# Altium schematic sheet FPGA_bank15_16.SchDoc
size 420 x 297 mm
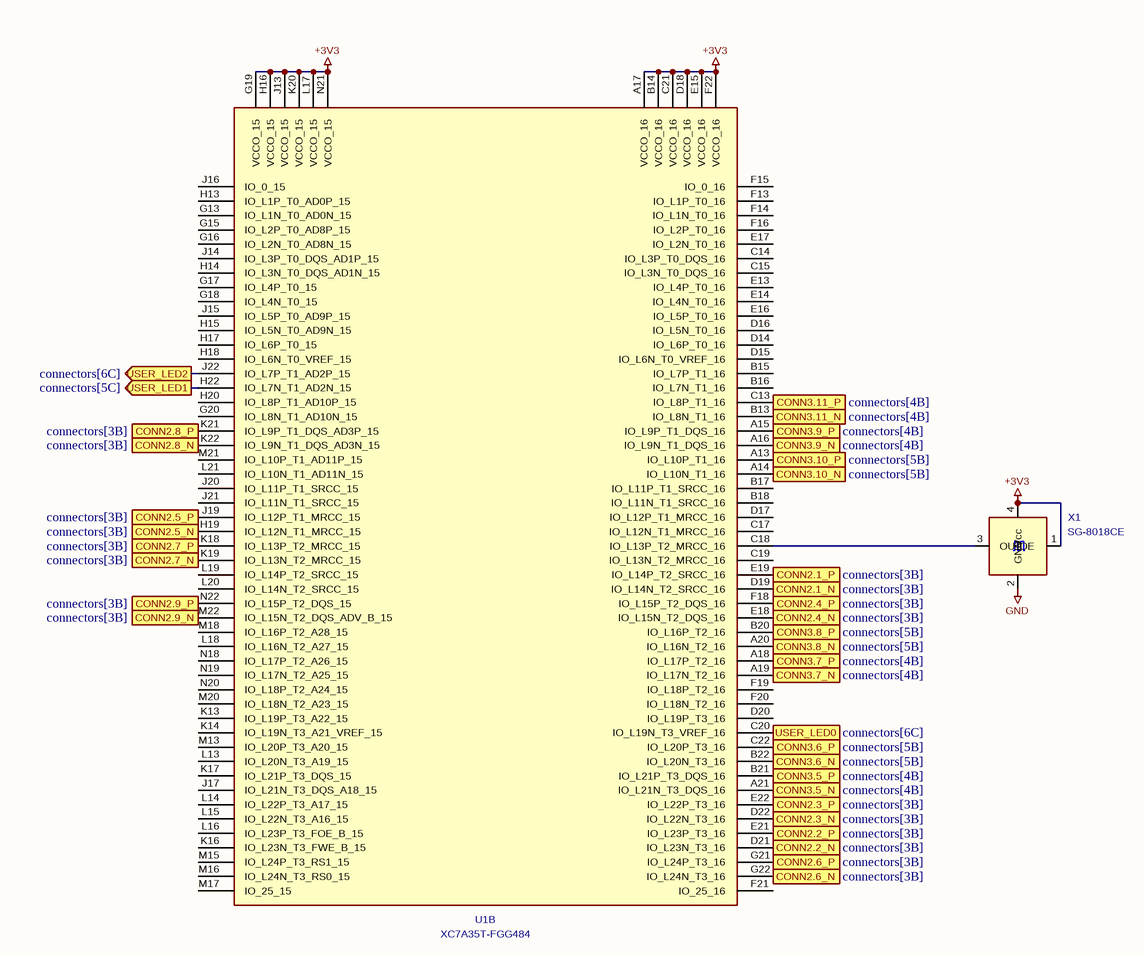
[diagram p0: FPGA_bank15_16.SchDoc]

## Parts
U1  XC7A35T-FGG484  [FB-BGA-484_23.0x23.0mm_Layout22x22_P1.0mm]  (part B of 7)
X1  SG-8018CE  [Crystal_SMD_3225-4Pin_3.2x2.5mm]

## Ports
CONN2.1_N (in, see connectors[3B]), CONN2.1_P (in, see connectors[3B]), CONN2.2_N (in, see connectors[3B]), CONN2.2_P (in, see connectors[3B]), CONN2.3_N (in, see connectors[3B]), CONN2.3_P (in, see connectors[3B]), CONN2.4_N (in, see connectors[3B]), CONN2.4_P (in, see connectors[3B]), CONN2.5_N (in, see connectors[3B]), CONN2.5_P (in, see connectors[3B]), CONN2.6_N (in, see connectors[3B]), CONN2.6_P (in, see connectors[3B]), CONN2.7_N (in, see connectors[3B]), CONN2.7_P (in, see connectors[3B]), CONN2.8_N (in, see connectors[3B]), CONN2.8_P (in, see connectors[3B]), CONN2.9_N (in, see connectors[3B]), CONN2.9_P (in, see connectors[3B]), CONN3.5_N (in, see connectors[4B]), CONN3.5_P (in, see connectors[4B]), CONN3.6_N (in, see connectors[5B]), CONN3.6_P (in, see connectors[5B]), CONN3.7_N (in, see connectors[4B]), CONN3.7_P (in, see connectors[4B]), CONN3.8_N (in, see connectors[5B]), CONN3.8_P (in, see connectors[5B]), CONN3.9_N (in, see connectors[4B]), CONN3.9_P (in, see connectors[4B]), CONN3.10_N (in, see connectors[5B]), CONN3.10_P (in, see connectors[5B]), CONN3.11_N (in, see connectors[4B]), CONN3.11_P (in, see connectors[4B]), USER_LED0 (out, see connectors[6C]), USER_LED1 (out, see connectors[5C]), USER_LED2 (out, see connectors[6C])

## Nets
+3V3: U1.A17(VCCO_16) U1.B14(VCCO_16) U1.C21(VCCO_16) U1.D18(VCCO_16) U1.E15(VCCO_16) U1.F22(VCCO_16) U1.G19(VCCO_15) U1.H16(VCCO_15) U1.J13(VCCO_15) U1.K20(VCCO_15) U1.L17(VCCO_15) U1.N21(VCCO_15) X1.1(OE) X1.4(Vcc)
GND: X1.2(GND)
CONN2.1_N: U1.D19(IO_L14N_T2_SRCC_16) ; port CONN2.1_N
CONN2.1_P: U1.E19(IO_L14P_T2_SRCC_16) ; port CONN2.1_P
CONN2.2_N: U1.D21(IO_L23N_T3_16) ; port CONN2.2_N
CONN2.2_P: U1.E21(IO_L23P_T3_16) ; port CONN2.2_P
CONN2.3_N: U1.D22(IO_L22N_T3_16) ; port CONN2.3_N
CONN2.3_P: U1.E22(IO_L22P_T3_16) ; port CONN2.3_P
CONN2.4_N: U1.E18(IO_L15N_T2_DQS_16) ; port CONN2.4_N
CONN2.4_P: U1.F18(IO_L15P_T2_DQS_16) ; port CONN2.4_P
CONN2.5_N: U1.H19(IO_L12N_T1_MRCC_15) ; port CONN2.5_N
CONN2.5_P: U1.J19(IO_L12P_T1_MRCC_15) ; port CONN2.5_P
CONN2.6_N: U1.G22(IO_L24N_T3_16) ; port CONN2.6_N
CONN2.6_P: U1.G21(IO_L24P_T3_16) ; port CONN2.6_P
CONN2.7_N: U1.K19(IO_L13N_T2_MRCC_15) ; port CONN2.7_N
CONN2.7_P: U1.K18(IO_L13P_T2_MRCC_15) ; port CONN2.7_P
CONN2.8_N: U1.K22(IO_L9N_T1_DQS_AD3N_15) ; port CONN2.8_N
CONN2.8_P: U1.K21(IO_L9P_T1_DQS_AD3P_15) ; port CONN2.8_P
CONN2.9_N: U1.M22(IO_L15N_T2_DQS_ADV_B_15) ; port CONN2.9_N
CONN2.9_P: U1.N22(IO_L15P_T2_DQS_15) ; port CONN2.9_P
CONN3.5_N: U1.A21(IO_L21N_T3_DQS_16) ; port CONN3.5_N
CONN3.5_P: U1.B21(IO_L21P_T3_DQS_16) ; port CONN3.5_P
CONN3.6_N: U1.B22(IO_L20N_T3_16) ; port CONN3.6_N
CONN3.6_P: U1.C22(IO_L20P_T3_16) ; port CONN3.6_P
CONN3.7_N: U1.A19(IO_L17N_T2_16) ; port CONN3.7_N
CONN3.7_P: U1.A18(IO_L17P_T2_16) ; port CONN3.7_P
CONN3.8_N: U1.A20(IO_L16N_T2_16) ; port CONN3.8_N
CONN3.8_P: U1.B20(IO_L16P_T2_16) ; port CONN3.8_P
CONN3.9_N: U1.A16(IO_L9N_T1_DQS_16) ; port CONN3.9_N
CONN3.9_P: U1.A15(IO_L9P_T1_DQS_16) ; port CONN3.9_P
CONN3.10_N: U1.A14(IO_L10N_T1_16) ; port CONN3.10_N
CONN3.10_P: U1.A13(IO_L10P_T1_16) ; port CONN3.10_P
CONN3.11_N: U1.B13(IO_L8N_T1_16) ; port CONN3.11_N
CONN3.11_P: U1.C13(IO_L8P_T1_16) ; port CONN3.11_P
USER_LED0: U1.C20(IO_L19N_T3_VREF_16) ; port USER_LED0
USER_LED1: U1.H22(IO_L7N_T1_AD2N_15) ; port USER_LED1
USER_LED2: U1.J22(IO_L7P_T1_AD2P_15) ; port USER_LED2
NetU1_C18: U1.C18(IO_L13P_T2_MRCC_16) X1.3(OUT)

Not connected (* = marked no-connect by the designer): U1 B15(IO_L7P_T1_16) B16(IO_L7N_T1_16) B17(IO_L11P_T1_SRCC_16) B18(IO_L11N_T1_SRCC_16) C14(IO_L3P_T0_DQS_16) C15(IO_L3N_T0_DQS_16) C17(IO_L12N_T1_MRCC_16) C19(IO_L13N_T2_MRCC_16) D14(IO_L6P_T0_16) D15(IO_L6N_T0_VREF_16) D16(IO_L5N_T0_16) D17(IO_L12P_T1_MRCC_16) D20(IO_L19P_T3_16) E13(IO_L4P_T0_16) E14(IO_L4N_T0_16) E16(IO_L5P_T0_16) E17(IO_L2N_T0_16) F13(IO_L1P_T0_16) F14(IO_L1N_T0_16) F15(IO_0_16) F16(IO_L2P_T0_16) F19(IO_L18P_T2_16) F20(IO_L18N_T2_16) F21(IO_25_16) G13(IO_L1N_T0_AD0N_15) G15(IO_L2P_T0_AD8P_15) G16(IO_L2N_T0_AD8N_15) G17(IO_L4P_T0_15) G18(IO_L4N_T0_15) G20(IO_L8N_T1_AD10N_15) H13(IO_L1P_T0_AD0P_15) H14(IO_L3N_T0_DQS_AD1N_15) H15(IO_L5N_T0_AD9N_15) H17(IO_L6P_T0_15) H18(IO_L6N_T0_VREF_15) H20(IO_L8P_T1_AD10P_15) J14(IO_L3P_T0_DQS_AD1P_15) J15(IO_L5P_T0_AD9P_15) J16(IO_0_15) J17(IO_L21N_T3_DQS_A18_15) J20(IO_L11P_T1_SRCC_15) J21(IO_L11N_T1_SRCC_15) K13(IO_L19P_T3_A22_15) K14(IO_L19N_T3_A21_VREF_15) K16(IO_L23N_T3_FWE_B_15) K17(IO_L21P_T3_DQS_15) L13(IO_L20N_T3_A19_15) L14(IO_L22P_T3_A17_15) L15(IO_L22N_T3_A16_15) L16(IO_L23P_T3_FOE_B_15) L18(IO_L16N_T2_A27_15) L19(IO_L14P_T2_SRCC_15) L20(IO_L14N_T2_SRCC_15) L21(IO_L10N_T1_AD11N_15) M13(IO_L20P_T3_A20_15) M15(IO_L24P_T3_RS1_15) M16(IO_L24N_T3_RS0_15) M17(IO_25_15) M18(IO_L16P_T2_A28_15) M20(IO_L18N_T2_A23_15) M21(IO_L10P_T1_AD11P_15) N18(IO_L17P_T2_A26_15) N19(IO_L17N_T2_A25_15) N20(IO_L18P_T2_A24_15)

## Notes on the sheet
- 1
- 2
- 3
- 4
- 5
- 6
- 7
- 8
- A
- B
- C
- D
- E
- Title:
- File: FPGA_bank15_16.kicad_sch
- Sheet: /
- F
- KiCad E.D.A.  kicad (5.1.4)-1
- Size: A3
- Date:
- Rev:
- Id: 1/1

## Library data of the parts
X1 = SG-5032CCN: JLCPCB: C390488; Value: SG-8018CE; Footprint: Crystal:Crystal_SMD_3225-4Pin_3.2x2.5mm
U1 = XC7A35T-FGG484: Value: XC7A35T-FGG484; Footprint: Package_BGA:FB-BGA-484_23.0x23.0mm_Layout22x22_P1.0mm